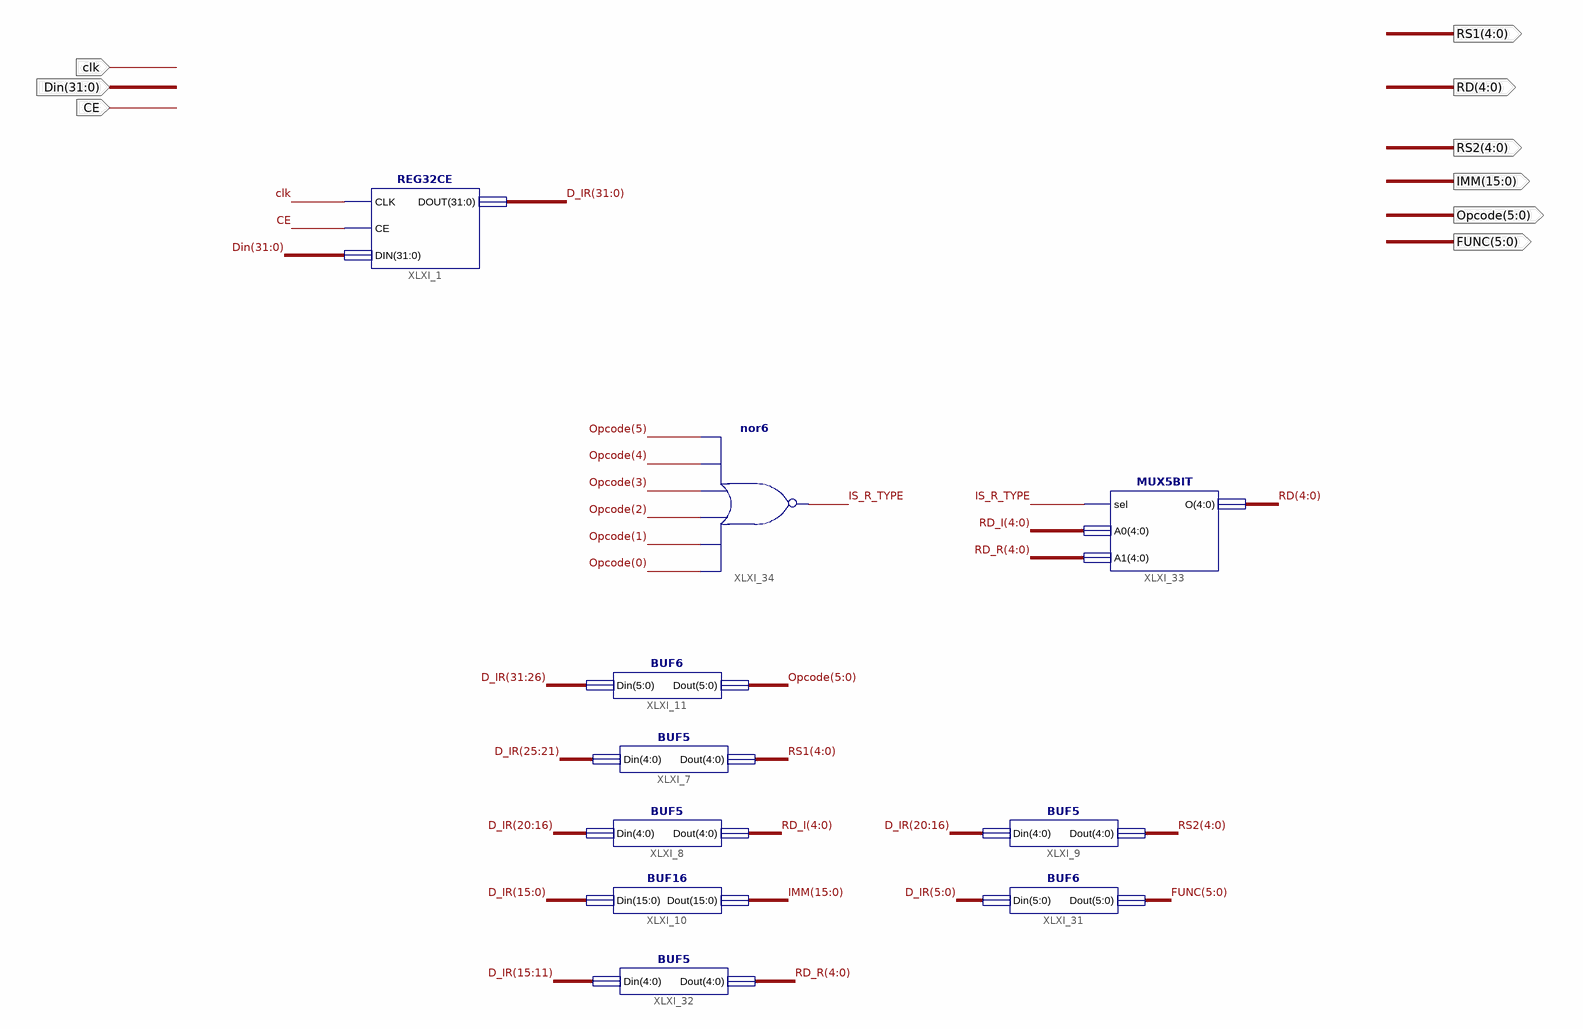
[diagram p0: schematic sheet 1]
// Xilinx ISE schematic IR.sch (spartan6) as structural Verilog: 10 symbols, 9 ports
module IR (
  input  [31:0] Din,
  input  CE,
  input  clk,
  output [4:0] RS1,
  output [5:0] Opcode,
  output [15:0] IMM,
  output [4:0] RS2,
  output [5:0] FUNC,
  output [4:0] RD
);

  wire IS_R_TYPE;
  wire [4:0] RD_I, RD_R;
  wire [31:0] D_IR;

  REG32CE XLXI_1 (.CLK(clk), .CE(CE), .DIN(Din), .DOUT(D_IR));
  BUF6 XLXI_11 (.Din(D_IR[31:26]), .Dout(Opcode));
  BUF5 XLXI_7 (.Din(D_IR[25:21]), .Dout(RS1));
  BUF5 XLXI_8 (.Din(D_IR[20:16]), .Dout(RD_I));
  BUF16 XLXI_10 (.Din(D_IR[15:0]), .Dout(IMM));
  BUF5 XLXI_9 (.Din(D_IR[20:16]), .Dout(RS2));
  BUF6 XLXI_31 (.Din(D_IR[5:0]), .Dout(FUNC));
  BUF5 XLXI_32 (.Din(D_IR[15:11]), .Dout(RD_R));
  MUX5BIT XLXI_33 (.sel(IS_R_TYPE), .A0(RD_I), .A1(RD_R), .O(RD));
  nor XLXI_34 (IS_R_TYPE, Opcode[0], Opcode[1], Opcode[2], Opcode[3], Opcode[4], Opcode[5]);
endmodule
